# EAGLE design Flight_Controller_board (EAGLE 8.6.3)
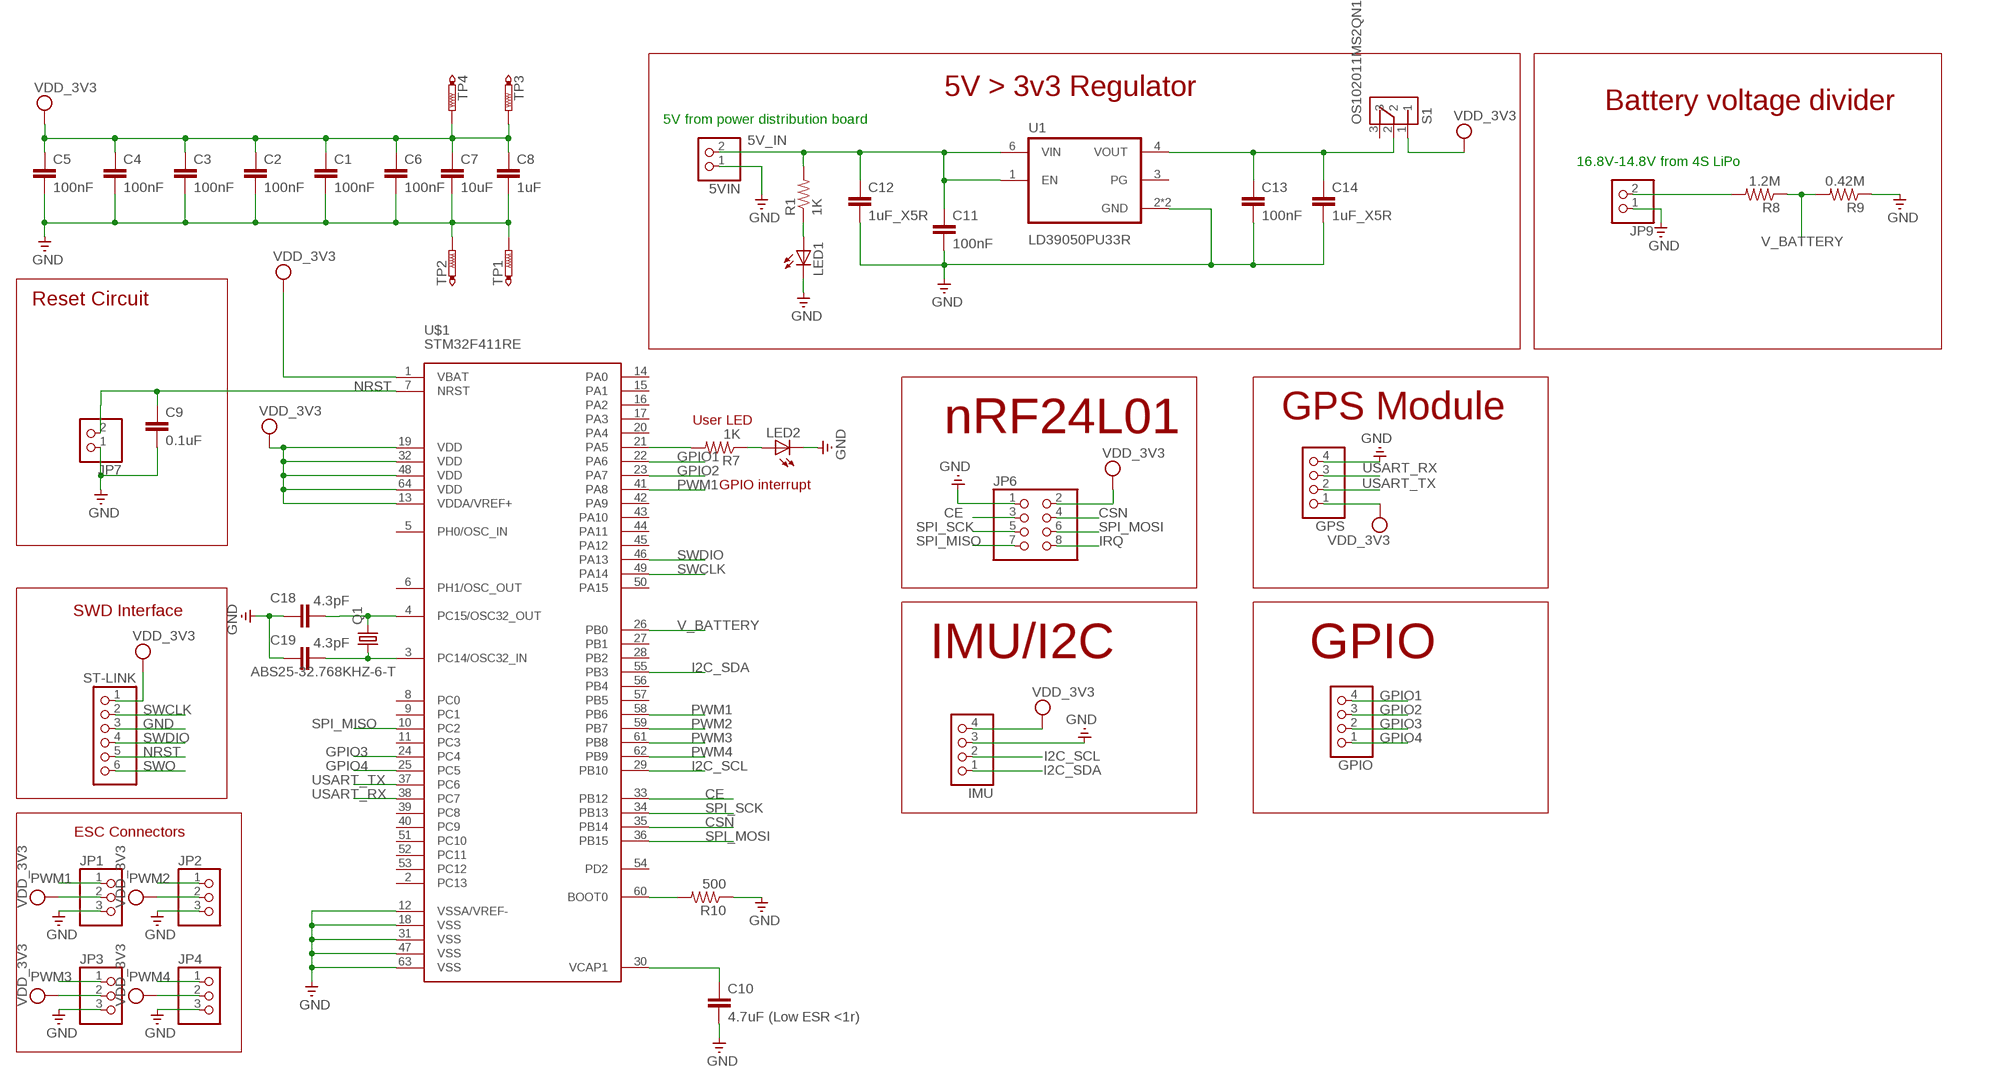
[diagram p0: schematic, sheet 1]

## Parts
5VIN  PINHD-1X2  [1X02]
C1  100nF  CAP0603-CAP  [0603-CAP]
C2  100nF  CAP0603-CAP  [0603-CAP]
C3  100nF  CAP0603-CAP  [0603-CAP]
C4  100nF  CAP0603-CAP  [0603-CAP]
C5  100nF  CAP0603-CAP  [0603-CAP]
C6  100nF  CAP0603-CAP  [0603-CAP]
C7  10uF  CAP0603-CAP  [0603-CAP]
C8  1uF  CAP0603-CAP  [0603-CAP]
C9  0.1uF  CAP0603-CAP  [0603-CAP]
C10  4.7uF (Low ESR <1r)  CAP1210  [1210]
C11  100nF  CAP0603-CAP  [0603-CAP]
C12  1uF_X5R  CAP0603-CAP  [0603-CAP]
C13  100nF  CAP0603-CAP  [0603-CAP]
C14  1uF_X5R  CAP0603-CAP  [0603-CAP]
C18  4.3pF  CAP0603-CAP  [0603-CAP]
C19  4.3pF  CAP0603-CAP  [0603-CAP]
GPIO  PINHD-1X4  [1X04]
GPS  PINHD-1X4  [1X04]
IMU  PINHD-1X4  [1X04]
JP1  PINHD-1X3  [1X03]
JP2  PINHD-1X3  [1X03]
JP3  PINHD-1X3  [1X03]
JP4  PINHD-1X3  [1X03]
JP6  PINHD-2X4  [2X04]
JP7  PINHD-1X2  [1X02]
JP9  PINHD-1X2  [1X02]
LED1  LEDCHIPLED_0603  [CHIPLED_0603]
LED2  LEDCHIPLED_0603  [CHIPLED_0603]
Q1  ABS25-32.768KHZ-6-T  MC-306  [MC-306]
R1  1K  RESISTOR0603-RES  [0603-RES]
R7  1K  RESISTOR0603-RES  [0603-RES]
R8  1.2M  RESISTOR0603-RES  [0603-RES]
R9  0.42M  RESISTOR0603-RES  [0603-RES]
R10  500  RESISTOR0603-RES  [0603-RES]
S1  OS102011MS2QN1  [SW_OS102011MS2QN1]
ST-LINK  PINHD-1X6  [1X06]
TP1  PTR1B1,27  [B1,27]
TP2  PTR1B1,27  [B1,27]
TP3  PTR1B1,27  [B1,27]
TP4  PTR1B1,27  [B1,27]
U1  LD39050PU33R  [SON95P300X300X100-7N]
U$1  STM32F411RE  STM32F411XC  [LQFP64]

## Nets
5V_IN: 5VIN.2 C11.1 C12.1 R1.2 U1.1(EN) U1.6(VIN)
CE: JP6.3 U$1.33(PB12)
CSN: JP6.4 U$1.35(PB14)
GND: 5VIN.1 C1.2 C2.2 C3.2 C4.2 C5.2 C6.2 C7.2 C8.2 C9.2 C10.2 C11.2 C12.2 C13.2 C14.2 C18.1 C19.1 GPS.4 IMU.3 JP1.3 JP2.3 JP3.3 JP4.3 JP6.1 JP7.1 JP9.1 LED1.C LED2.C R9.1 R10.1 ST-LINK.3 TP1.TP TP2.TP U1.2(GND) U1.7(GND) U$1.12(VSSA/VREF-) U$1.18(VSS) U$1.31(VSS) U$1.47(VSS) U$1.63(VSS)
GPIO1: GPIO.4 U$1.22(PA6)
GPIO2: GPIO.3 U$1.23(PA7)
GPIO3: GPIO.2 U$1.24(PC4)
GPIO4: GPIO.1 U$1.25(PC5)
I2C_SCL: IMU.2 U$1.29(PB10)
I2C_SDA: IMU.1 U$1.55(PB3)
IRQ: JP6.8
N$1: C10.1 U$1.30(VCAP1)
N$3: C13.1 C14.1 S1.2 U1.4(VOUT)
N$4: R7.2 U$1.21(PA5)
N$6: LED1.A R1.1
N$7: LED2.A R7.1
N$9: C18.2 Q1.4 U$1.4(PC15/OSC32_OUT)
N$10: C19.2 Q1.1 U$1.3(PC14/OSC32_IN)
N$13: JP9.2 R8.2
N$14: R10.2 U$1.60(BOOT0)
NRST: C9.1 JP7.2 ST-LINK.5 U$1.7(NRST)
PWM1: JP1.1 U$1.41(PA8) U$1.58(PB6)
PWM2: JP2.1 U$1.59(PB7)
PWM3: JP3.1 U$1.61(PB8)
PWM4: JP4.1 U$1.62(PB9)
SPI_MISO: JP6.7 U$1.10(PC2)
SPI_MOSI: JP6.6 U$1.36(PB15)
SPI_SCK: JP6.5 U$1.34(PB13)
SWCLK: ST-LINK.2 U$1.49(PA14)
SWDIO: ST-LINK.4 U$1.46(PA13)
SWO: ST-LINK.6
USART_RX: GPS.3 U$1.38(PC7)
USART_TX: GPS.2 U$1.37(PC6)
V_BATTERY: R8.1 R9.2 U$1.26(PB0)
VDD: C1.1 C2.1 C3.1 C4.1 C5.1 C6.1 C7.1 C8.1 GPS.1 IMU.4 JP1.2 JP2.2 JP3.2 JP4.2 JP6.2 S1.1 ST-LINK.1 TP3.TP TP4.TP U$1.1(VBAT) U$1.13(VDDA/VREF+) U$1.19(VDD) U$1.32(VDD) U$1.48(VDD) U$1.64(VDD) ; supply symbol labelled VDD_3V3
Unconnected: S1.3 U1.3(PG) U$1.2(PC13) U$1.5(PH0/OSC_IN) U$1.6(PH1/OSC_OUT) U$1.8(PC0) U$1.9(PC1) U$1.11(PC3) U$1.14(PA0) U$1.15(PA1) U$1.16(PA2) U$1.17(PA3) U$1.20(PA4) U$1.27(PB1) U$1.28(PB2) U$1.39(PC8) U$1.40(PC9) U$1.42(PA9) U$1.43(PA10) U$1.44(PA11) U$1.45(PA12) U$1.50(PA15) U$1.51(PC10) U$1.52(PC11) U$1.53(PC12) U$1.54(PD2) U$1.56(PB4) U$1.57(PB5)

## Notes on the sheet
- 5V > 3v3 Regulator
- Battery voltage divider
- 5V from power distribution board
- 16.8V-14.8V from 4S LiPo
- Reset Circuit
- GPS Module
- User LED
- nRF24L01
- GPIO interrupt
- SWD Interface
- IMU/I2C | GPIO
- ESC Connectors

## Library data of the parts
5VIN JP7 JP9 = pinhead:PINHD-1X2: PIN HEADER
C1-C14 C18 C19 = PatternAgents-ProtoPads:CAP: Capacitor Standard 0603 ceramic capacitor, and 0.1" leaded capacitor.
GPIO GPS IMU = pinhead:PINHD-1X4: PIN HEADER
JP1-JP4 = adafruit:PINHD-1X3: PIN HEADER
JP6 = adafruit:PINHD-2X4: PIN HEADER
LED1 LED2 = adafruit:LED: LED OSRAM: - CHIPLED LG R971, LG N971, LY N971, LG Q971, LY Q971, LO R971, LY R971 LH N974, LH R974 LS Q976, LO Q976, LY Q976 LO Q996 - Hyper CHIPLED LW Q18S LB Q993, LB Q99A, LB R99A - SideLED LS A670, LO A670, LY A670, LG A670, LP A670 LB A673, LV A673, LT A673, LW A673 LH A674 LY A675 LS A676, LA A676, LO A676, LY A676, LW A676 LS A679, LY A679, LG A679 - Hyper Micro SIDELED® LS Y876, LA Y876, LO Y876, LY Y876 LT Y87S - SmartLED LW L88C, LW L88S LB L89C, LB L89S, LG L890 LS L89K, LO L89K, LY L89K LS L896, LA L896, LO L896, LY L896 - TOPLED LS T670, LO T670, LY T670, LG T670, LP T670 LSG T670, LSP T670, LSY T670, LOP T670, LYG T670 LG T671, LOG T671, LSG T671 LB T673, LV T673, LT T673, LW T673 LH T674 LS T676, LA T676, LO T676, LY T676, LB T676, LH T676, LSB T676, LW T676 LB T67C, LV T67C, LT T67C, LS T67K, LO T67K, LY T67K, LW E67C LS E67B, LA E67B, LO E67B, LY E67B, LB E67C, LV E67C, LT E67C LW T67C LS T679, LY T679, LG T679 LS T770, LO T770, LY T770, LG T770, LP T770 LB T773, LV T773, LT T773, LW T773 LH T774 LS E675, LA E675, LY E675, LS T675 LS T776, LA T776, LO T776, LY T776, LB T776 LHGB T686 LT T68C, LB T68C - Hyper Mini TOPLED® LB M676 - Mini TOPLED Santana® LG M470 LS M47K, LO M47K, LY M47K Source: http://www.osram.convergy.de/
Q1 = crystal:MC-306: kHz RANGE CRYSTAL UNIT SMD Source: MC-306_405_406_E07X.PDF Homepage <http://www.epsontoyocom.co.jp>; MPN: MC-306 60.0KHZ 100PPM ,12.5PF; OC_FARNELL: 1278040; OC_NEWARK: 31M5576
R1 R7-R10 = PatternAgents-ProtoPads:RESISTOR: Resistor Basic schematic elements and footprints for 0603, 1206, and PTH resistors.
S1 = OS102011MS2QN1:OS102011MS2QN1: Switch Slide ON ON SPDT Top Slide 0.1A 12VDC 10000Cycles PC Pins Thru-Hole Bulk; AVAILABILITY: Unavailable; DESCRIPTION: Switch Slide ON ON SPDT Top Slide 0.1A 12VDC 10000Cycles PC Pins Thru-Hole Bulk; MF: C&K; MP: OS102011MS2QN1; PACKAGE: DO-201 C&amp;K Components; PRICE: None
ST-LINK = adafruit:PINHD-1X6: PIN HEADER
TP1-TP4 = testpad:PTR1: TEST PIN
U1 = LD39050PU33R:LD39050PU33R: LD39050 Series 500 mA 3.3 V Fixed Low Noise LDO Voltage Regulator - DFN-6; AVAILABILITY: Unavailable; DESCRIPTION: LD39050 Series 500 mA 3.3 V Fixed Low Noise LDO Voltage Regulator - DFN-6; MF: STMicroelectronics; MP: LD39050PU33R; PACKAGE: DFN-6 STMicroelectronics; PRICE: None
U$1 = stm32f411:STM32F411XC

## Board
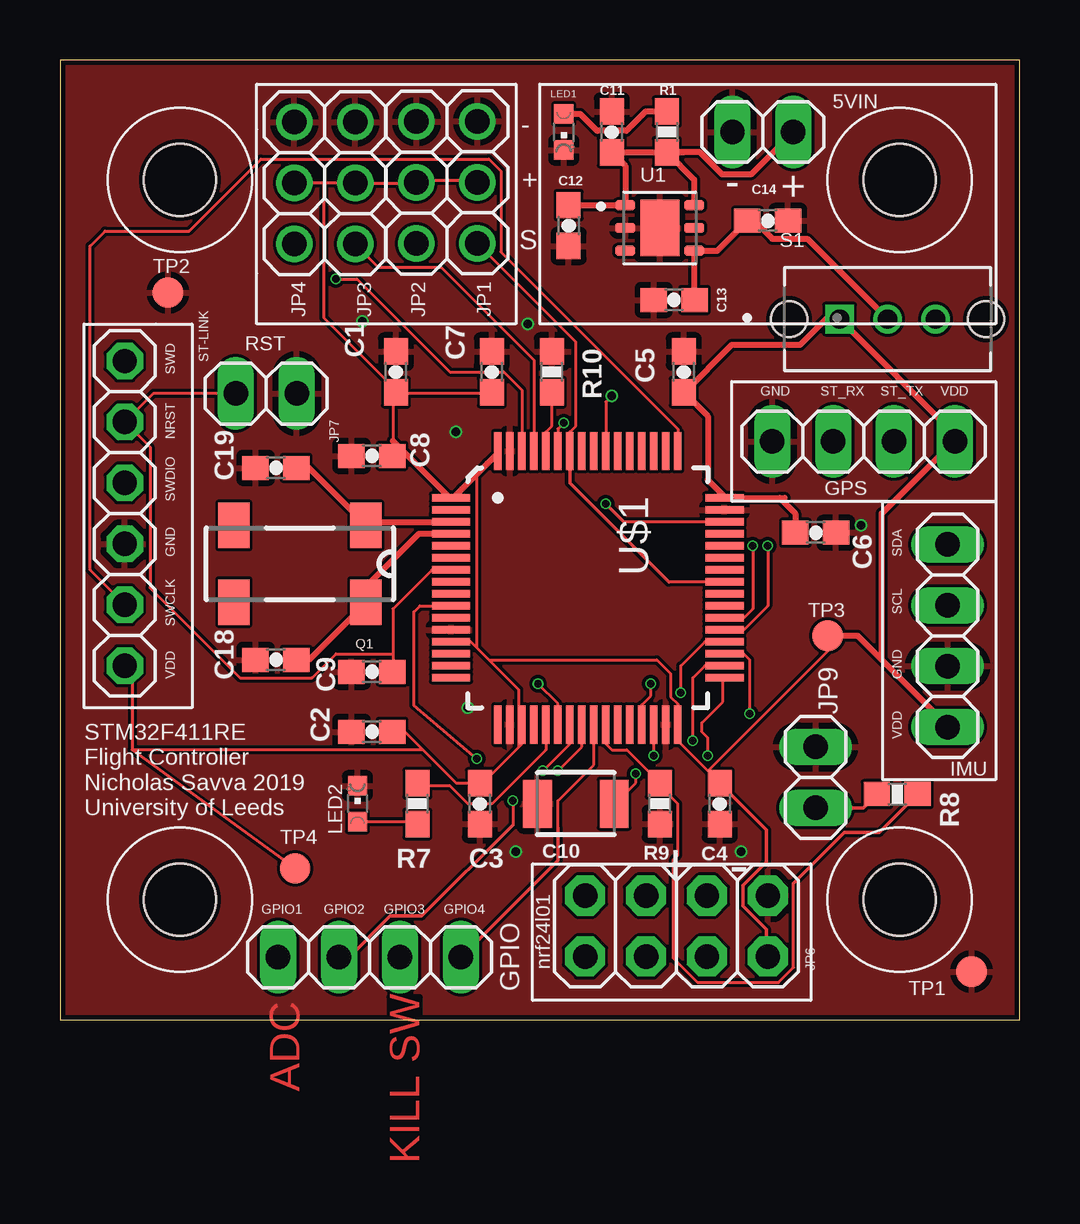
[diagram p1: board, top side]
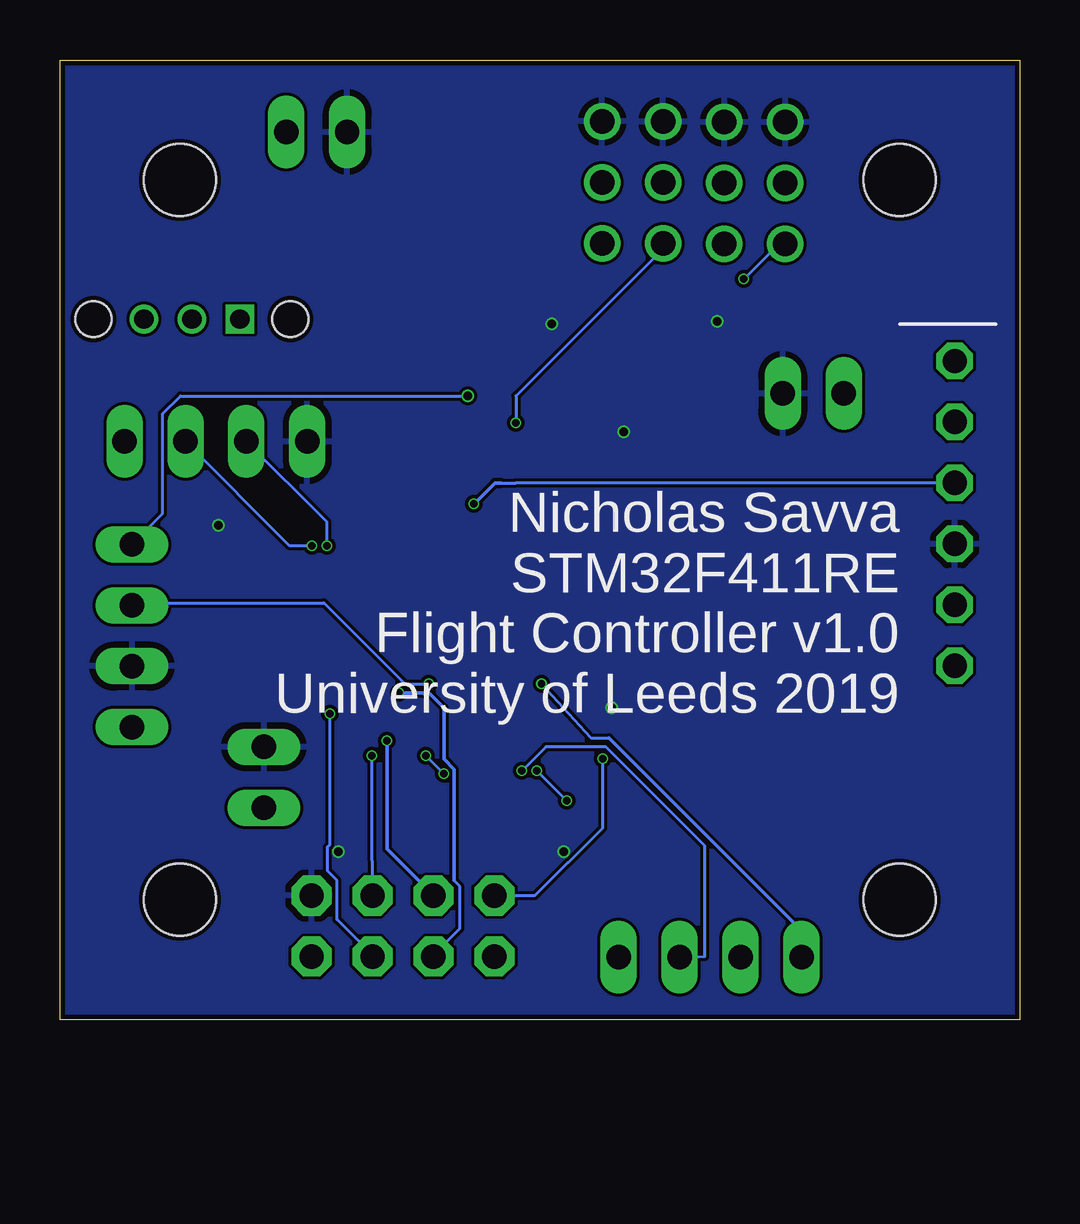
[diagram p2: board, bottom side, seen from below]

Size 40 x 40 mm. Coordinates in mm from the lower left corner, seen from the top.
Outline: 0,0 40,0 40,40 0,40 0,0
Copper layers (1*16): Top 0.035559375mm / dielectric 1.6mm / Bottom 0.035559375mm
Design rules "jlcpcb2layer": minimum track width 5mil, minimum drill 12mil, track to track 5mil, track to pad 5mil, pad to pad 5mil, via to via 5mil, smd to smd 5mil, copper to edge 8mil, drill to drill 6mil, minimum pad ring 5mil, minimum via ring 3mil, stop-mask expansion 2.5mil, vias tented up to drill 0mil, thermal gap 10mil
Holes 3 mm at 5,5 35,5 35,35 5,35

### Footprints (pad centres in the part's own frame; a part is rotated, then mirrored left to right if it is on the bottom)
1X02 = drill 1.016 long: 1 -1.27,0; 2 1.27,0
0603-CAP = smd 1.1 x 1: 1 -0.85,0; 2 0.85,0
1210 = smd 1.2 x 2: 1 -1.6,0; 2 1.6,0
1X04 = drill 1.016 long: 1 -3.81,0; 2 -1.27,0; 3 1.27,0; 4 3.81,0
1X03 = drill 1.016: 1 -2.54,0; 2 0,0; 3 2.54,0
2X04 = drill 1.016 pad 1.676 octagon: 1 -3.81,-1.27; 2 -3.81,1.27; 3 -1.27,-1.27; 4 -1.27,1.27; 5 1.27,-1.27; 6 1.27,1.27; 7 3.81,-1.27; 8 3.81,1.27
CHIPLED_0603 = smd 0.8 x 0.8: A 0,-0.75; C 0,0.75
MC-306 = smd 1.3 x 1.9: 1 -2.75,-1.6; 2 2.75,-1.6; 3 2.75,1.6; 4 -2.75,1.6
0603-RES = smd 1.1 x 1: 1 -0.85,0; 2 0.85,0
SW_OS102011MS2QN1 = drill 0.8 square: 1 -2,0 | drill 0.8: 2 0,0; 3 2,0 | hole 1.5: -4.1,0; 4.1,0
1X06 = drill 1.016 octagon: 1 -6.35,0; 2 -3.81,0; 3 -1.27,0; 4 1.27,0; 5 3.81,0; 6 6.35,0
B1,27 = smd 1.27 x 1.27: TP 0,0
SON95P300X300X100-7N = smd 0.84 x 0.4: 1 -1.435,0.95; 2 -1.435,0; 3 -1.435,-0.95; 4 1.435,-0.95; 5 1.435,0; 6 1.435,0.95 | smd 1.625 x 2.365: 7 0,0
LQFP64 = smd 0.3 x 1.6: 1 -3.75,-5.7; 2 -3.25,-5.7; 3 -2.75,-5.7; 4 -2.25,-5.7; 5 -1.75,-5.7; 6 -1.25,-5.7; 7 -0.75,-5.7; 8 -0.25,-5.7; 9 0.25,-5.7; 10 0.75,-5.7; 11 1.25,-5.7; 12 1.75,-5.7; 13 2.25,-5.7; 14 2.75,-5.7; 15 3.25,-5.7; 16 3.75,-5.7; 33 3.75,5.7; 34 3.25,5.7; 35 2.75,5.7; 36 2.25,5.7; 37 1.75,5.7; 38 1.25,5.7; 39 0.75,5.7; 40 0.25,5.7; 41 -0.25,5.7; 42 -0.75,5.7; 43 -1.25,5.7; 44 -1.75,5.7; 45 -2.25,5.7; 46 -2.75,5.7; 47 -3.25,5.7; 48 -3.75,5.7 | smd 1.6 x 0.3: 17 5.7,-3.75; 18 5.7,-3.25; 19 5.7,-2.75; 20 5.7,-2.25; 21 5.7,-1.75; 22 5.7,-1.25; 23 5.7,-0.75; 24 5.7,-0.25; 25 5.7,0.25; 26 5.7,0.75; 27 5.7,1.25; 28 5.7,1.75; 29 5.7,2.25; 30 5.7,2.75; 31 5.7,3.25; 32 5.7,3.75; 49 -5.7,3.75; 50 -5.7,3.25; 51 -5.7,2.75; 52 -5.7,2.25; 53 -5.7,1.75; 54 -5.7,1.25; 55 -5.7,0.75; 56 -5.7,0.25; 57 -5.7,-0.25; 58 -5.7,-0.75; 59 -5.7,-1.25; 60 -5.7,-1.75; 61 -5.7,-2.25; 62 -5.7,-2.75; 63 -5.7,-3.25; 64 -5.7,-3.75

### Placement (x,y rotation side)
5VIN  29.3,37 0 top
C1  14,27 90 top
C2  13,12 180 top
C3  17.5,9 270 top
C4  27.5,9 270 top
C5  26,27 90 top
C6  31.5,20.3 0 top
C7  18,27 90 top
C8  13,23.5 180 top
C9  13,14.5 180 top
C10  21.5,9 180 top
C11  23,37 90 top
C12  21.2,33.1 270 top
C13  25.6,30 180 top
C14  29.5,33.3 0 top
C18  9,15 0 top
C19  9,23 0 top
GPIO  12.9,2.6 180 top
GPS  33.5,24.1 180 top
IMU  37,16 270 top
JP1  17.4,34.9 90 top
JP2  14.86,34.89 90 top
JP3  12.31,34.87 90 top
JP4  9.77,34.87 90 top
JP6  25.7,3.9 180 top
JP7  8.6,26.1 180 top
JP9  31.5,10.1 270 top
LED1  21,37 180 top
LED2  12.4,9 0 top
Q1  10,19 180 top
R1  25.3,37 270 top
R7  14.9,9 90 top
R8  34.9,9.4 180 top
R9  25,9 90 top
R10  20.5,27 270 top
S1  34.5,29.2 0 top
ST-LINK  2.7,21.1 90 top
TP1  38,2 0 top
TP2  4.5,30.3 0 top
TP3  32,16 0 top
TP4  9.8,6.3 0 top
U1  25,33 0 top
U$1  22,18 270 top

### Tracks (layer width: path | path; a pad name or v marks a point on that pad's centre or on a via)
5V_IN
  Top 0.254: 26,36.15 26.68,36.15 27.61,35.22 28.79,35.22 5VIN.2 | 26,36.15 R1.2 26.43,35.02 U1.6 | 23.57,34 23.57,35.59 C11.1 26,36.15 | 23.57,34 U1.1 | C12.1 23.52,33.95 23.57,34
CE  (via drill 0.3)
  Top 0.127: v27,11 27,11.75 26.75,12 26.75,12.38 27.62,13.25 27.62,14.25 U$1.33
  Bottom 0.127: v27,11 27,7.12 26.95,5.17 JP6.3
CSN  (via drill 0.3)
  Top 0.127: v28.75,12.75 28.75,15 28.5,15.25 27.75,15.25 U$1.35
  Bottom 0.127: 28.75,7.5 28.75,8 | 28.75,8 v28.75,12.75 | JP6.4 26.95,2.67 28.45,4.17 28.45,5.8 28.85,6.2 28.85,7.19 28.75,7.29 28.75,8
GND  (via drill 0.35)
  other vias: 16.5,24.5 19.5,29 33.4,20.6 12.6,29.1 17,13 19,7 28.4,7
  pour Top: 0,0 0,40 40,40 40,0
  pour Bottom: 0,0 40,0 40,40 0,40
GPIO1  (via drill 0.3)
  Top 0.127: 20.75,13.12 20.75,13 | 20.75,13 20.75,12.38 U$1.22 | 20.75,13 20.75,13.18 v19.93,14
  Bottom 0.127: v19.93,14 17.88,11.75 17.12,11.75
  Bottom 0.15: 17.12,11.75 9.09,3.71 GPIO.4
GPIO2  (via drill 0.3)
  Top 0.127: v20.12,10.38 21.25,11.5 21.25,12.25 U$1.23 | v18.88,9.12 18.88,8.12
  Top 0.15: 18.88,8.12 15.08,4.33 13.77,4.33 12.04,2.6 GPIO.3
  Bottom 0.127: v18.88,9.12 v20.12,10.38
GPIO3  (via drill 0.3)
  Top 0.127: v20.75,10.38 21.75,11.38 21.75,12.25 U$1.24
  Bottom 0.127: v20.75,10.38 19.75,11.38 17.25,11.38 13.12,7.25 13.12,2.62 GPIO.2
GPIO4
  Top 0.127: 20.75,7.62 20.75,8 20.75,9.12 22.25,10.62 22.25,12.25 U$1.25 | 16.75,2.62 GPIO.1
  Top 0.15: GPIO.1 20.75,6.64 20.75,8
I2C_SCL  (via drill 0.3)
  Top 0.127: U$1.29 24.25,12.38 24.25,13.12 24.62,13.5 v24.62,14
  Bottom 0.127: IMU.2 37,17.38 29,17.38 25.62,14 v24.62,14
I2C_SDA  (via drill 0.35)
  Top 0.127: v23,26 22.75,25.75 U$1.55
  Bottom 0.127: IMU.1 35.72,21.09 35.72,25.26 34.98,26 v23,26
N$1  (via drill 0.3)
  Top 0.127: v24.75,11 24.75,12.25 U$1.30 | v24,10.25 24,9.88 23.12,9 C10.1
  Bottom 0.127: v24,10.25 v24.75,11
N$3
  Top 0.254: S1.2 31.15,32.55 29.7,32.55 28.94,33.3 C14.1 27.4,32.05 U1.4 26.43,30.02 C13.1
N$4
  Top 0.127: R7.2 15,9.75 16.25,9.75 17,9 18,9 20.25,11.25 20.25,12.25 U$1.21
N$6
  Top 0.254: R1.1 24.41,37.85 23.61,37.05 22.39,37.05 21.69,37.75 LED1.A
N$7
  Top 0.127: LED2.A 12.5,8.25 14.88,8.25 R7.1
N$9
  Top 0.127: 10.38,15 9.88,15 C18.2 | 12.75,17.38 Q1.4
  Top 0.254: 12.75,17.38 10.38,15 | U$1.4 14.95,20.25 12.75,18.05 Q1.4
N$10
  Top 0.127: 10.38,23 9.88,23 C19.2 | 16.25,20.75 U$1.3 | 12.75,20.62 12.62,20.75 Q1.1 12.75,20.62
  Top 0.254: 10.38,23 12.62,20.75 16.25,20.75
N$13
  Top 0.127: 31.5,8.75 JP9.2
  Top 0.15: R8.2 33.48,8.83 JP9.2
N$14
  Top 0.127: R10.2 20.5,26.12 20.5,24.75 20.25,24.5 20.25,23.75 U$1.60
NRST
  Top 0.127: 13.88,15.25 13.88,17.12 15.5,18.75 16.25,18.75 U$1.7 | 13.88,15.25 13.88,14.5 C9.1 | 2.62,25 ST-LINK.5 | 13.88,15.25 11.5,15.25 10.5,14.25 7.5,14.25 3.75,18 3.75,23.88 2.75,24.88 ST-LINK.5 | JP7.2 3.89,26.1 ST-LINK.5
PWM1
  Top 0.127: 25.38,18.25 27.62,18.25 U$1.41 | 21.25,23.62 U$1.58 21.25,23.75 21.25,24.5 21.5,24.75 21.5,28.25 17.5,32.25 JP1.1
  Top 0.152: 25.38,18.25 21.25,22.38 U$1.58
PWM2  (via drill 0.3)
  Top 0.127: v21,24.88 20.75,24.62 20.75,23.75 U$1.59
  Bottom 0.127: v21,24.88 21,26 14.75,32.25 JP2.1
PWM3
  Top 0.127: U$1.61 19.75,23.75 19.75,27.5 15.88,31.38 13.25,31.38 12.38,32.25 JP3.1
PWM4  (via drill 0.3)
  Top 0.127: v11.5,30.88 12.38,30.88 16.25,27 18.5,27 19.25,26.25 19.25,23.75 U$1.62
  Bottom 0.127: v11.5,30.88 10.12,32.25 9.88,32.25 JP4.1
SPI_MISO  (via drill 0.3)
  Top 0.127: v17.38,10.88 14.75,13.1 14.75,17 15,17.25 16.25,17.25 U$1.10
  Bottom 0.127: JP6.7 21.82,5.17 20.2,5.17 18.83,6.55 18.81,6.55 17.38,7.98 v17.38,10.88
SPI_MOSI  (via drill 0.3)
  Top 0.127: v25.88,13.62 25.88,14.75 26.88,15.75 27.62,15.75 U$1.36
  Bottom 0.127: 23.57,5.8 23.32,5.55 23.32,3.8 24.45,2.67 JP6.6
  Bottom 0.15: 23.57,5.8 23.57,10.07 23.57,10.43 24,10.86 24,13 24.57,13.57 24.8,13.57 24.86,13.62 v25.88,13.62
SPI_SCK  (via drill 0.3)
  Top 0.127: v26.38,11.62 26.38,14.25 26.88,14.75 27.62,14.75 U$1.34
  Bottom 0.127: 24.32,5.17 JP6.5
  Bottom 0.15: JP6.5 26.38,7.12 v26.38,11.62
SWCLK
  Top 0.127: U$1.49 25.75,23.75 25.75,24.62 18.38,32 18.38,35.38 17.88,35.88 8.38,35.88 5.38,32.88 1.88,32.88 1.25,32.25 1.25,18.75 2.62,17.38 ST-LINK.2
SWDIO  (via drill 0.3)
  Top 0.127: 23.5,20.75 27.62,20.75 U$1.46
  Top 0.152: 23.5,20.75 v22.75,21.5
  Bottom 0.127: 21.62,22.38 21,22.38 2.75,22.38 ST-LINK.4
  Bottom 0.152: v22.75,21.5 21.88,22.38 21.62,22.38
USART_RX  (via drill 0.3)
  Top 0.127: v28.88,19.75 28.88,17.12 28.5,16.75 27.75,16.75 U$1.38
  Bottom 0.127: v28.88,19.75 28.88,20.75 GPS.3
USART_TX  (via drill 0.3)
  Top 0.127: v29.5,19.75 29.5,17.25 28.5,16.25 27.75,16.25 U$1.37
  Bottom 0.127: v29.5,19.75 30.42,19.75 GPS.2
V_BATTERY
  Top 0.127: U$1.26 22.75,12.25 22.75,11.5 23,11.25 23.62,11.25 25,9.88 R9.2 25,9.75 25.75,9 25.75,6.85 25.57,6.67 25.57,2.55 26.57,1.55 29.95,1.55 30.57,2.17 30.57,5.67
  Top 0.15: 30.57,5.67 32.7,7.8 34.15,7.8 R8.1
VDD
  Top 0.127: 27.75,21.75 U$1.48 | 26,26.12 C5.1 | 37.38,24.1 GPS.1 37.25,24.1 | 27,10.38 25.75,11.62 25.75,12.25 U$1.32 25.75,12.38 25.75,13 | 27,10.38 27.5,9.88 C4.1 27.5,9.75 | 32.62,16 TP3.TP 32.62,16 | 37,12.25 IMU.4 | 32.62,16 27,10.38 | 29.45,3.67 29.45,3 29.45,2.67 JP6.2 | 3,11.25 3,14.5 2.75,14.75 ST-LINK.1 | 3,11.25 TP4.TP | 11,34.88 12.25,34.88 JP3.2 12.38,34.88 14.75,34.88 JP2.2 14.88,35 17.38,35 JP1.2 | 11,34.88 9.88,34.88 JP4.2 | 16.38,21.75 U$1.1 16.25,21.75 | 18.25,23.62 U$1.64 | 14,26.12 13.88,26 13.88,24.12 13.88,23.5 C8.1 | 14,26.12 C1.1 | 14,26.12 18,26.12 C7.1 | 14,26.12 C1.1 | 15.12,11.25 14.38,12 13.88,12 C2.1 | 15.12,11.25 16.5,9.88 17.5,9.88 C3.1 17.5,9.75 19.12,11.38 | 19.12,11.38 19.25,11.5 19.25,12.25 U$1.19 | 17.88,15 19.12,13.75 19.12,11.38 | 17.88,15 17.38,15.5 | 17.38,15.5 17.12,15.75 16.38,15.75 U$1.13 | 11,34.88 11,29.25 14,26.25 C1.1 | 15.12,11.25 3,11.25 | 25.75,13.12 25.75,13 | 17.88,15 24.88,15 25.46,14.42 25.46,13.45 25.75,13.16 25.75,13 | 17.81,23.19 17.38,22.75 17.38,15.5
  Top 0.15: C4.1 29.45,7.9 29.45,6.58 28.47,5.6 28.47,4.74 29.45,3.76 29.45,3
  Top 0.254: 32.62,16 33.25,16 34.25,15 | 37,12.25 34.25,15 | 34.25,15 34.25,21 34.25,21.1 37.25,24.1 | 18.25,23.62 17.81,23.19 16.75,22.12 16.38,21.75 | 13.88,24.12 16.25,21.75 | GPS.1 37.31,24.39 S1.1 31.93,29.2 30.85,28.12 28,28.12 26,26.12 | C5.1 27,25.15 27,22.5 27.75,21.75 | U$1.48 30,21.75 | 30,21.75 30.2,21.75 | 30,21.75 30.65,21.1 C6.1

### Text on the board
Top: ADC | KILL SW
tPlace: RST | SWD | GND | ST_RX | ST_TX | VDD | NRST | SWDIO | GND | SDA | SCL | SWCLK | VDD | GND | VDD | STM32F411RE / Flight Controller / Nicholas Savva 2019 / University of Leeds | GPIO1 | GPIO2 | GPIO3 | GPIO4
tNames: - | + | - | + | S | + | - | nrf24l01
bNames: Nicholas Savva / STM32F411RE / Flight Controller v1.0 / University of Leeds 2019